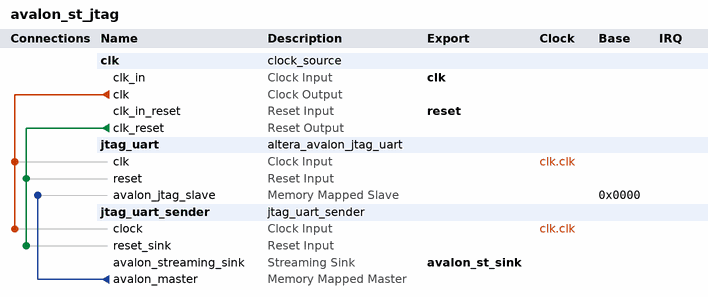
[diagram p0: system contents]
# Platform Designer (Qsys) system avalon_st_jtag, Cyclone V Unknown
# Parameters at their usual value, and those the tool derives, are not listed.
package require -exact qsys 16.0
create_system avalon_st_jtag
set_project_property DEVICE_FAMILY {Cyclone V}
set_project_property DEVICE Unknown

add_instance clk clock_source 16.0
set_instance_parameter_value clk clockFrequency 50000000

add_instance jtag_uart altera_avalon_jtag_uart 16.0
set_instance_parameter_value jtag_uart readBufferDepth 8
set_instance_parameter_value jtag_uart simInteractiveOptions INTERACTIVE_ASCII_OUTPUT
set_instance_parameter_value jtag_uart writeBufferDepth 1024

add_instance jtag_uart_sender jtag_uart_sender 1.0

# connections
add_connection clk.clk jtag_uart.clk clock
add_connection clk.clk jtag_uart_sender.clock clock
add_connection clk.clk_reset jtag_uart.reset reset
add_connection clk.clk_reset jtag_uart_sender.reset_sink reset
add_connection jtag_uart_sender.avalon_master jtag_uart.avalon_jtag_slave avalon
set_connection_parameter_value jtag_uart_sender.avalon_master/jtag_uart.avalon_jtag_slave baseAddress 0x0000

# exported interfaces
add_interface avalon_st_sink avalon_streaming sink
set_interface_property avalon_st_sink EXPORT_OF jtag_uart_sender.avalon_streaming_sink
add_interface clk clock sink
set_interface_property clk EXPORT_OF clk.clk_in
add_interface reset reset sink
set_interface_property reset EXPORT_OF clk.clk_in_reset

set_interconnect_requirement {$system} qsys_mm.clockCrossingAdapter HANDSHAKE
set_interconnect_requirement {$system} qsys_mm.maxAdditionalLatency 1

save_system avalon_st_jtag.qsys
